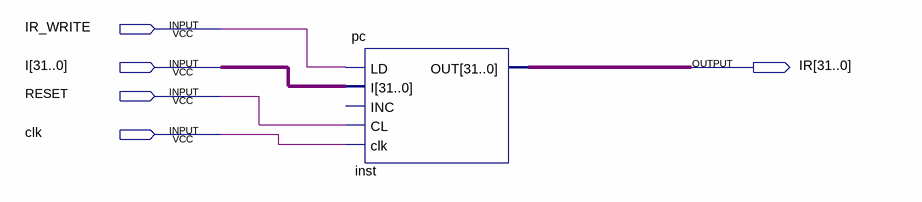
[diagram p0: schematic sheet]
// Quartus schematic ir.bdf as structural Verilog: 1 symbols, 5 pins
module ir (
  input  IR_WRITE,
  input  [31:0] I,
  input  RESET,
  input  clk,
  output [31:0] IR
);

  pc inst (.LD(IR_WRITE), .I(I), .CL(RESET), .clk(clk), .OUT(IR));  // open: INC
endmodule
